# Altium schematic sheet MaleHeader.SchDoc
size A
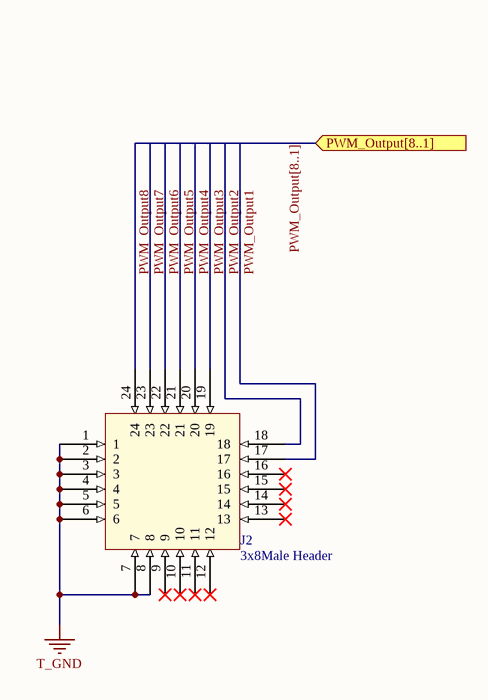
[diagram p0: MaleHeader.SchDoc]

## Parts
J2  3x8Male Header  [3x8 Male Header]

## Ports
PWM_Output[8..1] (in)

## Nets
T_GND: J2.1 J2.2 J2.3 J2.4 J2.5 J2.6 J2.7 J2.8
PWM_Output1: J2.17
PWM_Output2: J2.18
PWM_Output3: J2.19
PWM_Output4: J2.20
PWM_Output5: J2.21
PWM_Output6: J2.22
PWM_Output7: J2.23
PWM_Output8: J2.24

Not connected (* = marked no-connect by the designer): J2 9* 10* 11* 12* 13* 14* 15* 16*

## Buses and harness runs
bus PWM_Output[8..1] = port PWM_Output[8..1]

## Library data of the parts
J2 = 3x8Male Header: 3x8 male header